# EAGLE design NSL_Tracker-2.0 (EAGLE 5.11)

## Sheet 1 of 6
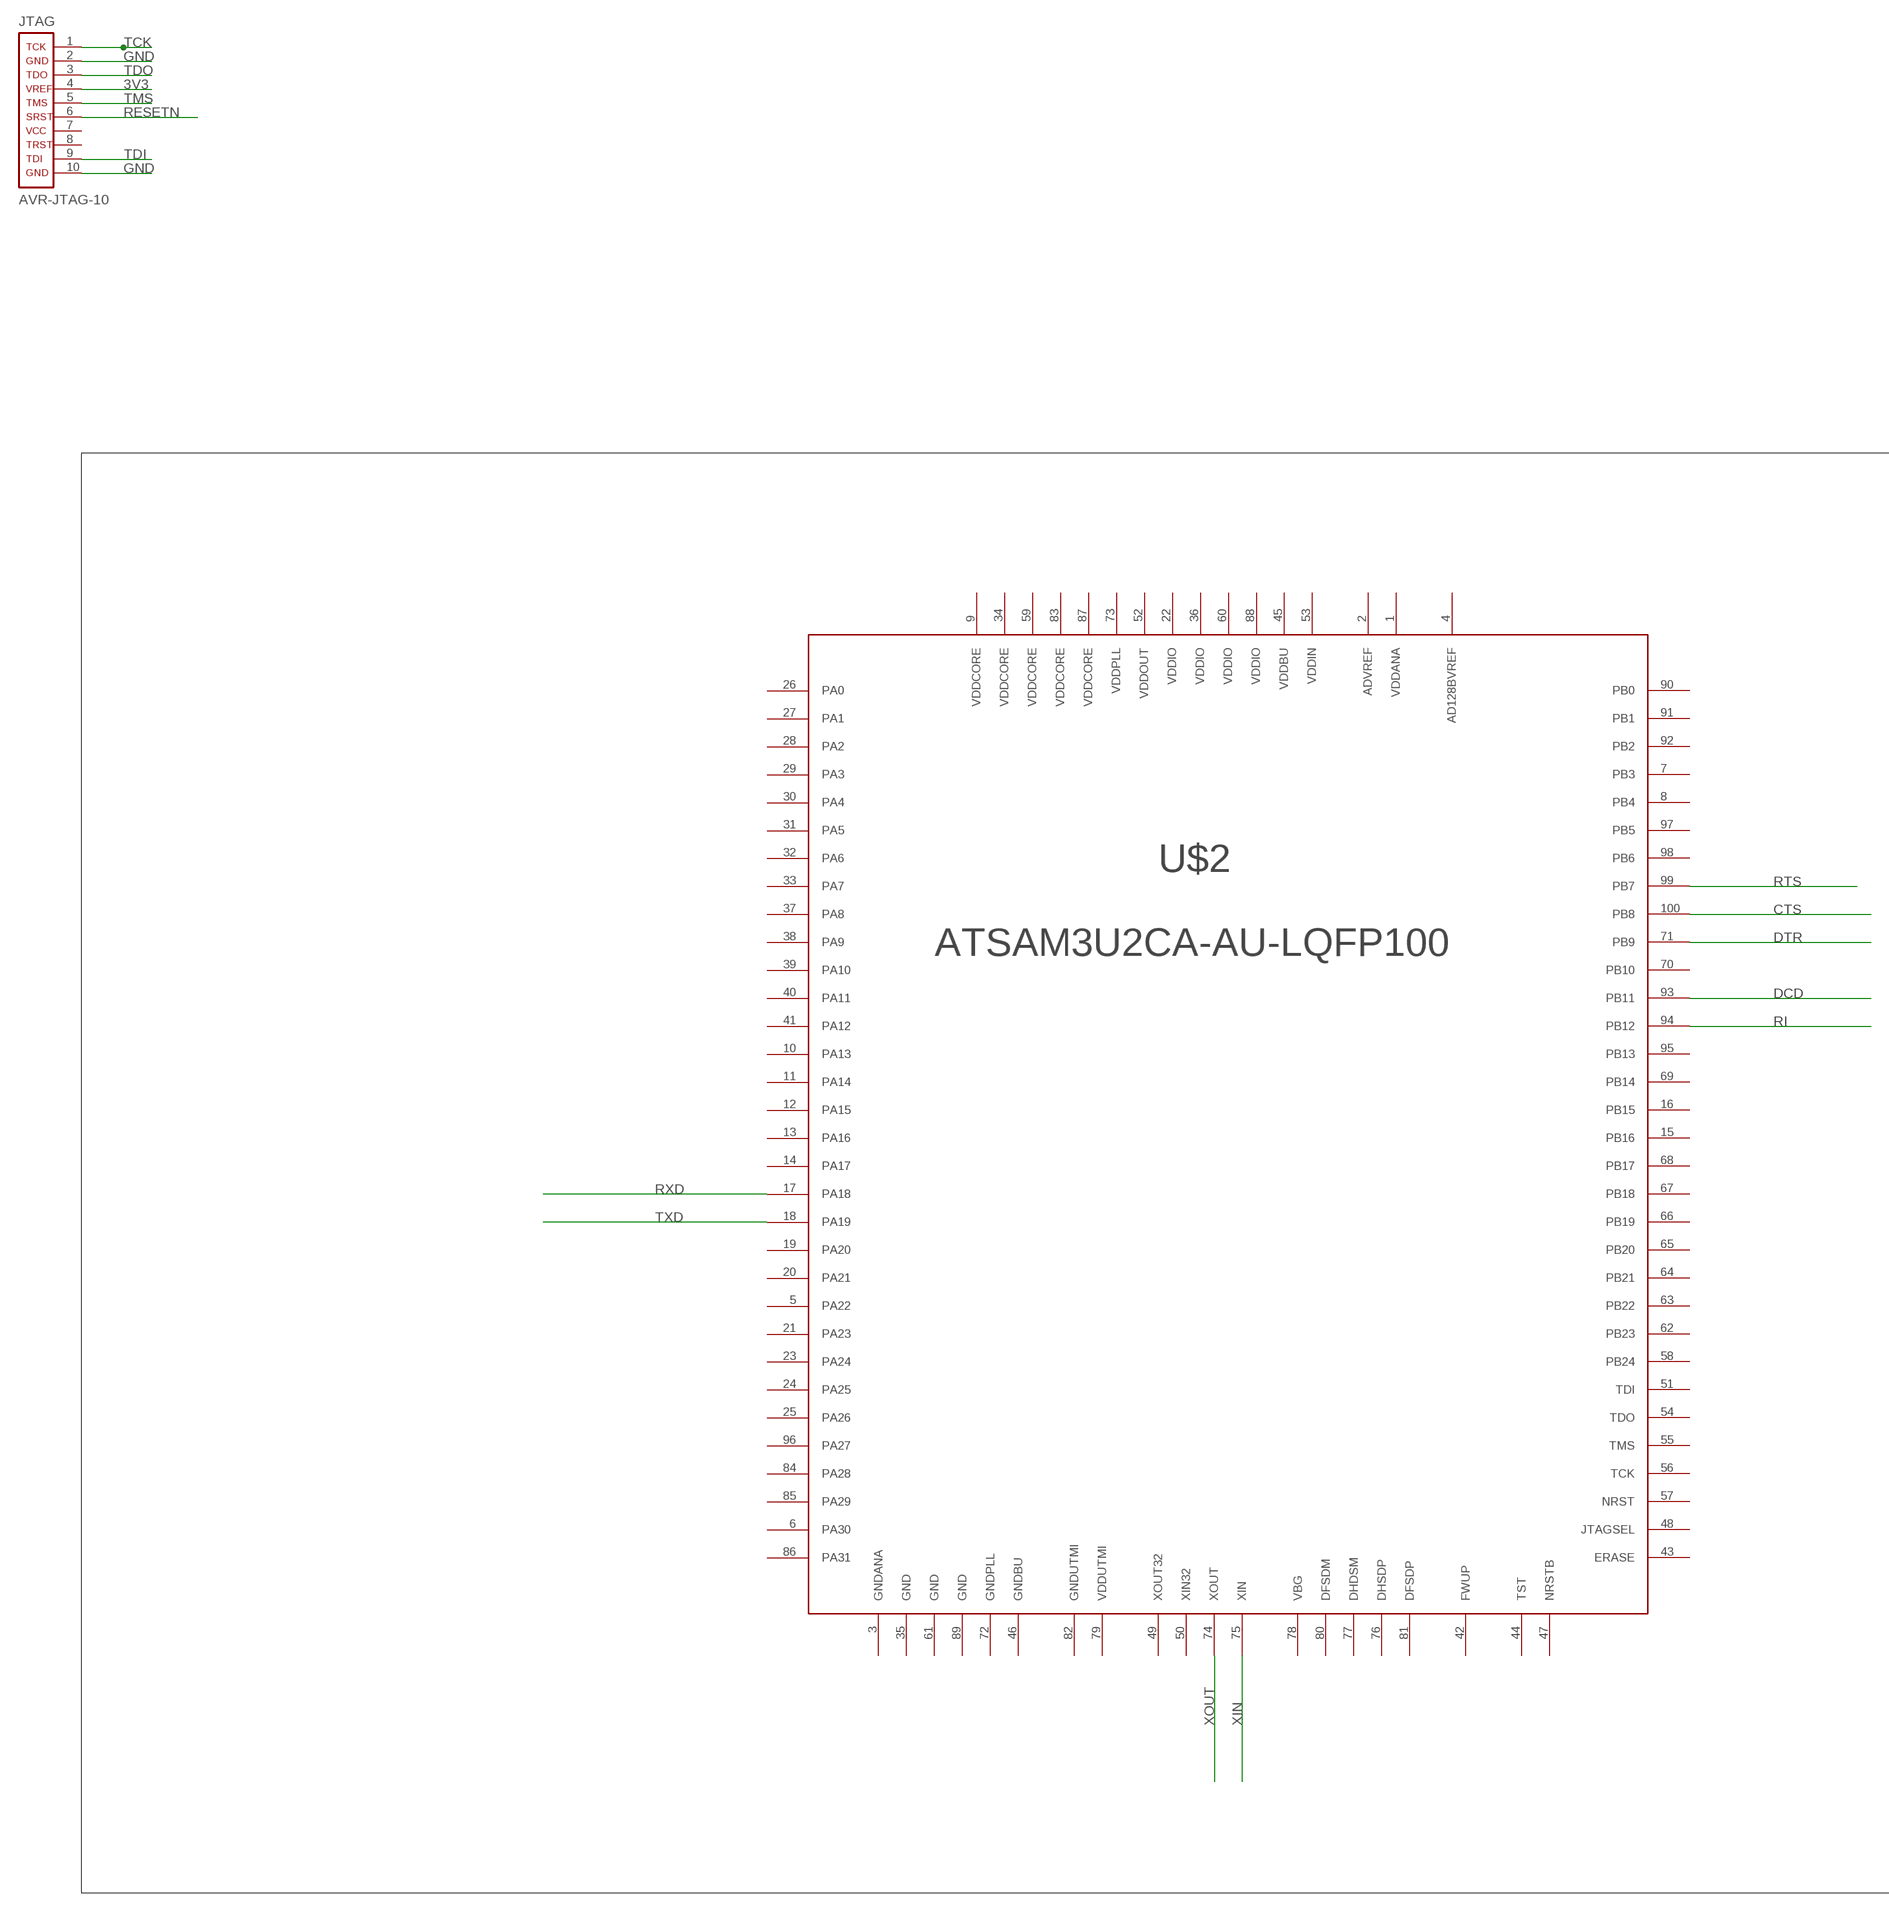
[diagram p0: schematic, sheet 1, part 1 of 2]
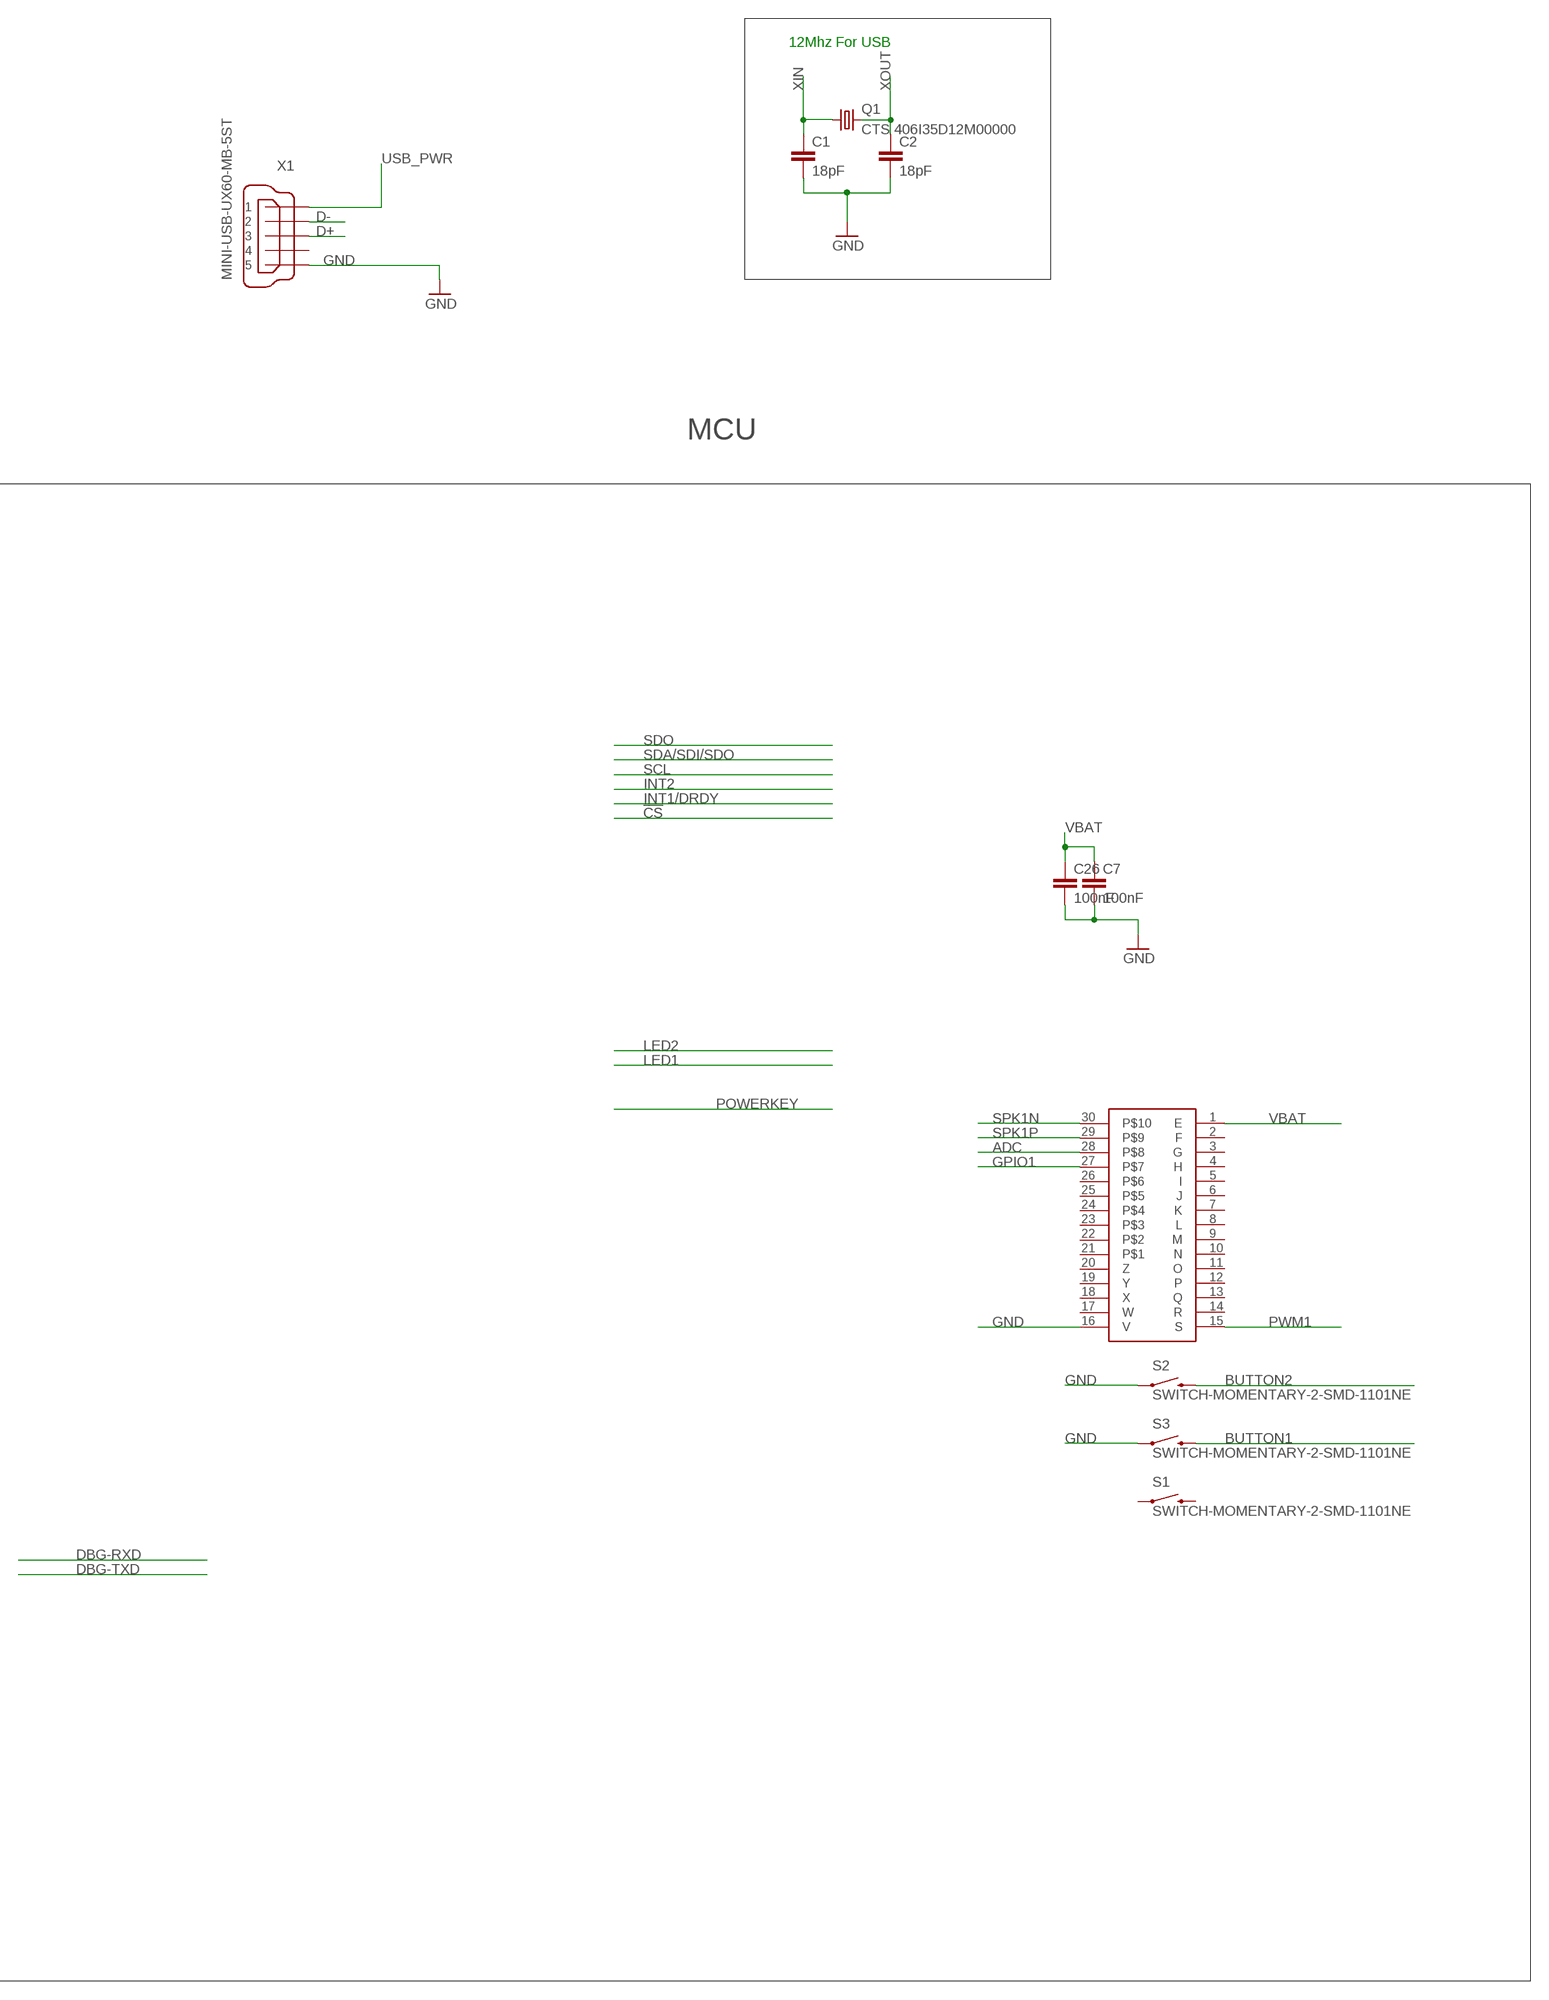
[diagram p1: schematic, sheet 1, part 2 of 2]

### Parts
C1  18pF  CAP0805  [0805]
C2  18pF  CAP0805  [0805]
C7  100nF  CAP0805  [0805]
C26  100nF  CAP0805  [0805]
JTAG  AVR-JTAG-10  [AVR-JTAG-10]
Q1  CTS 406I35D12M00000  CRYSTALCTS406  [CTS406]
S1  SWITCH-MOMENTARY-2-SMD-1101NE  [TACTILE-SWITCH-1101NE]
S2  SWITCH-MOMENTARY-2-SMD-1101NE  [TACTILE-SWITCH-1101NE]
S3  SWITCH-MOMENTARY-2-SMD-1101NE  [TACTILE-SWITCH-1101NE]
U$1  M30  [M50-2X15]
U$2  ATSAM3U2CA-AU-LQFP100  [LQFP100]
X1  MINI-USB-UX60-MB-5ST  [UX60-MB-5ST]

### Nets
3V3: JTAG.4
ADC: U$1.28 ; also sheet 2
BUTTON1: S3.P$2
BUTTON2: S2.P$2
CTS: U$2.100(PB8) ; also sheet 2
D+: X1.3
D-: X1.2
DCD: U$2.93(PB11) ; also sheet 2
DTR: U$2.71(PB9) ; also sheet 2
GND: C1.2 C2.2 C7.2 C26.2 JTAG.2 JTAG.10 S2.P$1 S3.P$1 U$1.16(V) X1.5 ; also sheet 2,3,4,5,6
GPIO1: U$1.27 ; also sheet 2
PWM1: U$1.15(S) ; also sheet 2
RESETN: JTAG.6
RI: U$2.94(PB12) ; also sheet 2
RTS: U$2.99(PB7) ; also sheet 2
RXD: U$2.17(PA18) ; also sheet 2
SPK1N: U$1.30 ; also sheet 2
SPK1P: U$1.29 ; also sheet 2
TCK: JTAG.1
TDI: JTAG.9
TDO: JTAG.3
TMS: JTAG.5
TXD: U$2.18(PA19) ; also sheet 2
USB_PWR: X1.1 ; also sheet 4
VBAT: C7.1 C26.1 U$1.1(E) ; also sheet 2,3,4,6
XIN: C1.1 Q1.1 U$2.75(XIN)
XOUT: C2.1 Q1.3 U$2.74(XOUT)
Unconnected: JTAG.7 JTAG.8 S1.P$1 S1.P$2 U$1.2(F) U$1.3(G) U$1.4(H) U$1.5(I) U$1.6(J) U$1.7(K) U$1.8(L) U$1.9(M) U$1.10(N) U$1.11(O) U$1.12(P) U$1.13(Q) U$1.14(R) U$1.17(W) U$1.18(X) U$1.19(Y) U$1.20(Z) U$1.21 U$1.22 U$1.23 U$1.24 U$1.25 U$1.26 U$2.1(VDDANA) U$2.2(ADVREF) U$2.3(GNDANA) U$2.4(AD128BVREF) U$2.5(PA22) U$2.6(PA30) U$2.7(PB3) U$2.8(PB4) U$2.9(VDDCORE) U$2.10(PA13) U$2.11(PA14) U$2.12(PA15) U$2.13(PA16) U$2.14(PA17) U$2.15(PB16) U$2.16(PB15) U$2.19(PA20) U$2.20(PA21) U$2.21(PA23) U$2.22(VDDIO) U$2.23(PA24) U$2.24(PA25) U$2.25(PA26) U$2.26(PA0) U$2.27(PA1) U$2.28(PA2) U$2.29(PA3) U$2.30(PA4) U$2.31(PA5) U$2.32(PA6) U$2.33(PA7) U$2.34(VDDCORE) U$2.35(GND) U$2.36(VDDIO) U$2.37(PA8) U$2.38(PA9) U$2.39(PA10) U$2.40(PA11) U$2.41(PA12) U$2.42(FWUP) U$2.43(ERASE) U$2.44(TST) U$2.45(VDDBU) U$2.46(GNDBU) U$2.47(NRSTB) U$2.48(JTAGSEL) U$2.49(XOUT32) U$2.50(XIN32) U$2.51(TDI) U$2.52(VDDOUT) U$2.53(VDDIN) U$2.54(TDO) U$2.55(TMS) U$2.56(TCK) U$2.57(NRST) U$2.58(PB24) U$2.59(VDDCORE) U$2.60(VDDIO) U$2.61(GND) U$2.62(PB23) U$2.63(PB22) U$2.64(PB21) U$2.65(PB20) U$2.66(PB19) U$2.67(PB18) U$2.68(PB17) U$2.69(PB14) U$2.70(PB10) U$2.72(GNDPLL) U$2.73(VDDPLL) U$2.76(DHSDP) U$2.77(DHDSM) U$2.78(VBG) U$2.79(VDDUTMI) U$2.80(DFSDM) U$2.81(DFSDP) U$2.82(GNDUTMI) U$2.83(VDDCORE) U$2.84(PA28) U$2.85(PA29) U$2.86(PA31) U$2.87(VDDCORE) U$2.88(VDDIO) U$2.89(GND) U$2.90(PB0) U$2.91(PB1) U$2.92(PB2) U$2.95(PB13) U$2.96(PA27) U$2.97(PB5) U$2.98(PB6) X1.4

### Notes on the sheet
- 12Mhz For USB
- MCU

## Sheet 2 of 6
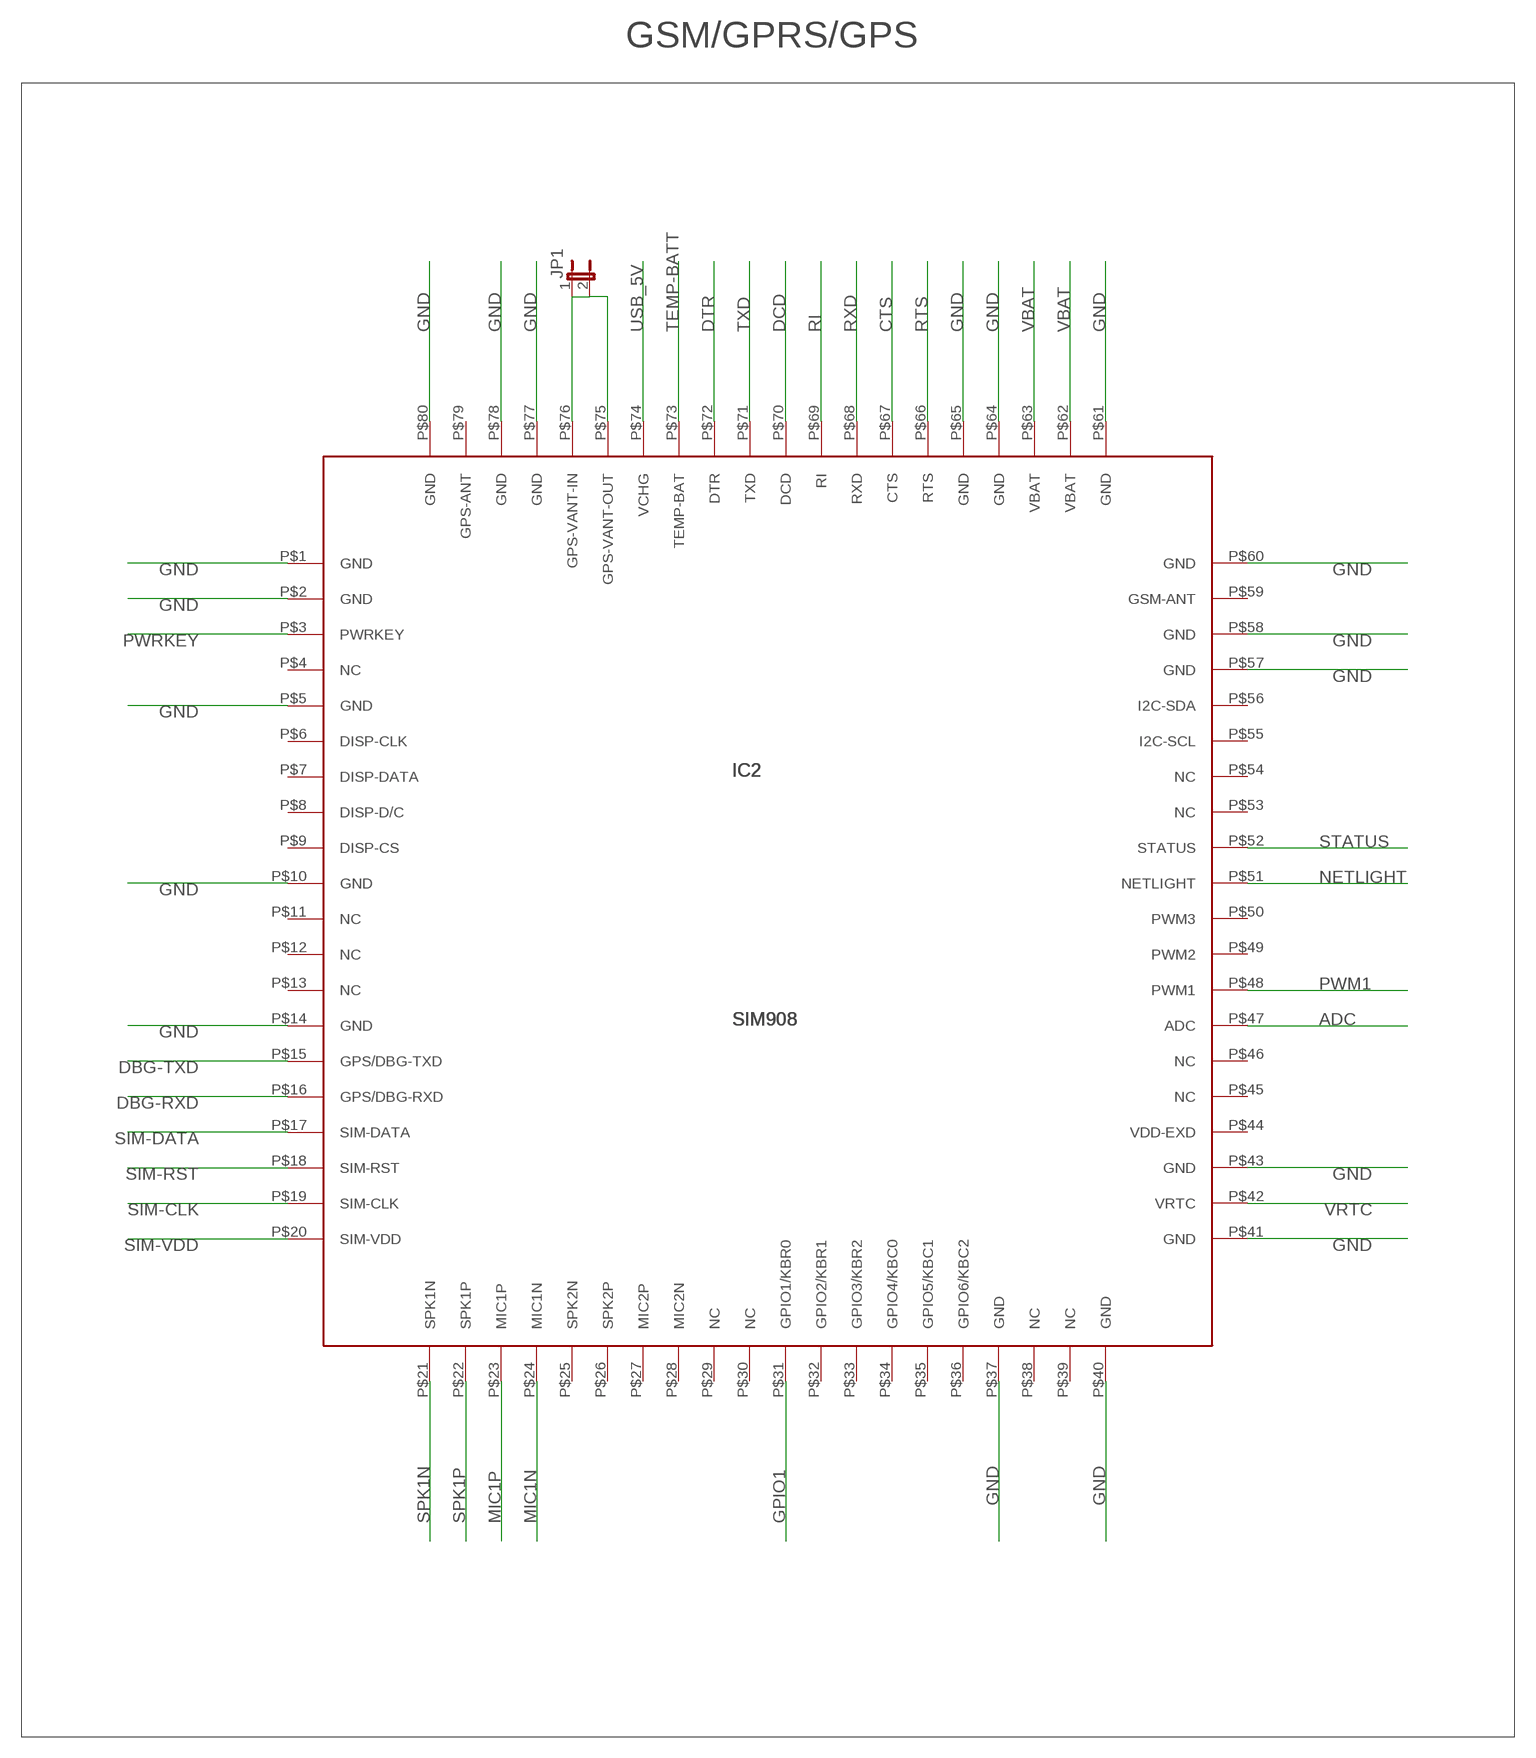
[diagram p2: schematic, sheet 2]

### Parts
IC2  SIM908  [SIM908]
JP1  JUMPER-2SMD-NC  [SJ_2S]

### Nets
ADC: IC2.P$47(ADC) ; also sheet 1
CTS: IC2.P$67(CTS) ; also sheet 1
DBG-RXD: IC2.P$16(GPS/DBG-RXD) ; also sheet 1
DBG-TXD: IC2.P$15(GPS/DBG-TXD) ; also sheet 1
DCD: IC2.P$70(DCD) ; also sheet 1
DTR: IC2.P$72(DTR) ; also sheet 1
GND: IC2.P$1(GND) IC2.P$2(GND) IC2.P$5(GND) IC2.P$10(GND) IC2.P$14(GND) IC2.P$37(GND) IC2.P$40(GND) IC2.P$41(GND) IC2.P$43(GND) IC2.P$57(GND) IC2.P$58(GND) IC2.P$60(GND) IC2.P$61(GND) IC2.P$64(GND) IC2.P$65(GND) IC2.P$77(GND) IC2.P$78(GND) IC2.P$80(GND) ; also sheet 1,3,4,5,6
GPIO1: IC2.P$31(GPIO1/KBR0) ; also sheet 1
MIC1N: IC2.P$24(MIC1N) ; also sheet 5
MIC1P: IC2.P$23(MIC1P) ; also sheet 5
N$4: IC2.P$75(GPS-VANT-OUT) IC2.P$76(GPS-VANT-IN) JP1.1 JP1.2
NETLIGHT: IC2.P$51(NETLIGHT) ; also sheet 3
PWM1: IC2.P$48(PWM1) ; also sheet 1
PWRKEY: IC2.P$3(PWRKEY) ; also sheet 3
RI: IC2.P$69(RI) ; also sheet 1
RTS: IC2.P$66(RTS) ; also sheet 1
RXD: IC2.P$68(RXD) ; also sheet 1
SIM-CLK: IC2.P$19(SIM-CLK) ; also sheet 3
SIM-DATA: IC2.P$17(SIM-DATA) ; also sheet 3
SIM-RST: IC2.P$18(SIM-RST) ; also sheet 3
SIM-VDD: IC2.P$20(SIM-VDD) ; also sheet 3
SPK1N: IC2.P$21(SPK1N) ; also sheet 1
SPK1P: IC2.P$22(SPK1P) ; also sheet 1
STATUS: IC2.P$52(STATUS) ; also sheet 3
TEMP-BATT: IC2.P$73(TEMP-BAT) ; also sheet 4
TXD: IC2.P$71(TXD) ; also sheet 1
USB_5V: IC2.P$74(VCHG) ; also sheet 4
VBAT: IC2.P$62(VBAT) IC2.P$63(VBAT) ; also sheet 1,3,4,6
VRTC: IC2.P$42(VRTC) ; also sheet 4
Unconnected: IC2.P$4(NC) IC2.P$6(DISP-CLK) IC2.P$7(DISP-DATA) IC2.P$8(DISP-D/C) IC2.P$9(DISP-CS) IC2.P$11(NC) IC2.P$12(NC) IC2.P$13(NC) IC2.P$25(SPK2N) IC2.P$26(SPK2P) IC2.P$27(MIC2P) IC2.P$28(MIC2N) IC2.P$29(NC) IC2.P$30(NC) IC2.P$32(GPIO2/KBR1) IC2.P$33(GPIO3/KBR2) IC2.P$34(GPIO4/KBC0) IC2.P$35(GPIO5/KBC1) IC2.P$36(GPIO6/KBC2) IC2.P$38(NC) IC2.P$39(NC) IC2.P$44(VDD-EXD) IC2.P$45(NC) IC2.P$46(NC) IC2.P$49(PWM2) IC2.P$50(PWM3) IC2.P$53(NC) IC2.P$54(NC) IC2.P$55(I2C-SCL) IC2.P$56(I2C-SDA) IC2.P$59(GSM-ANT) IC2.P$79(GPS-ANT)

### Notes on the sheet
- GSM/GPRS/GPS

## Sheet 3 of 6
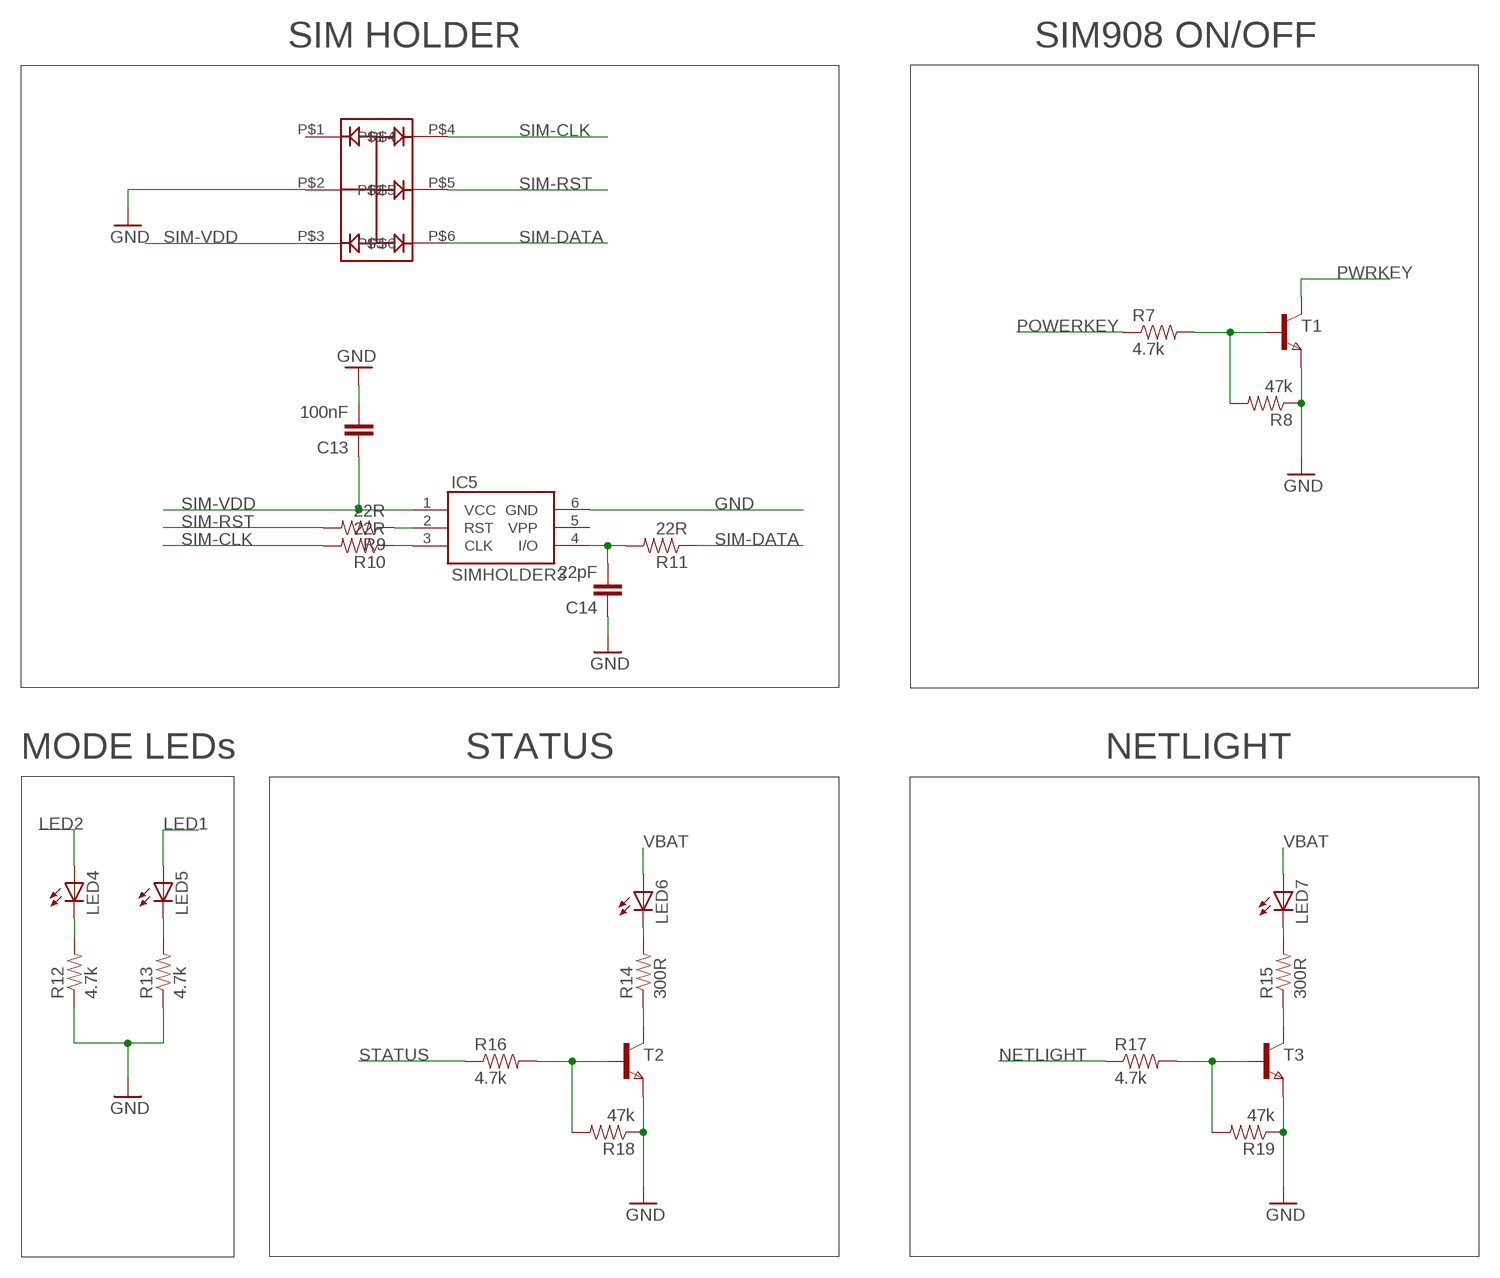
[diagram p3: schematic, sheet 3]

### Parts
C13  100nF  CAP0805  [0805]
C14  22pF  CAP0805  [0805]
IC4  SMF05C  [SC-88]
IC5  SIMHOLDER3  [SIMHOLDER3]
LED4  LEDCHIP-LED0603  [CHIP-LED0603]
LED5  LEDCHIP-LED0603  [CHIP-LED0603]
LED6  LEDCHIP-LED0603  [CHIP-LED0603]
LED7  LEDCHIP-LED0603  [CHIP-LED0603]
R7  4.7k  RESISTOR0805-RES  [0805]
R8  47k  RESISTOR0805-RES  [0805]
R9  22R  RESISTOR0805-RES  [0805]
R10  22R  RESISTOR0805-RES  [0805]
R11  22R  RESISTOR0805-RES  [0805]
R12  4.7k  RESISTOR0805-RES  [0805]
R13  4.7k  RESISTOR0805-RES  [0805]
R14  300R  RESISTOR0805-RES  [0805]
R15  300R  RESISTOR0805-RES  [0805]
R16  4.7k  RESISTOR0805-RES  [0805]
R17  4.7k  RESISTOR0805-RES  [0805]
R18  47k  RESISTOR0805-RES  [0805]
R19  47k  RESISTOR0805-RES  [0805]
T1  NPNSOT23  [SOT-23]
T2  NPNSOT23  [SOT-23]
T3  NPNSOT23  [SOT-23]

### Nets
GND: C13.2 C14.1 IC4.P$2 IC5.6(GND) R8.1 R12.1 R13.1 R18.1 R19.1 T1.2(E) T2.2(E) T3.2(E) ; also sheet 1,2,4,5,6
LED1: LED5.A ; also sheet 1
LED2: LED4.A ; also sheet 1
N$6: R17.2 R19.2 T3.3(B)
N$7: R7.2 R8.2 T1.3(B)
N$8: IC5.2(RST) R9.1
N$9: IC5.3(CLK) R10.1
N$10: C14.2 IC5.4(I/O) R11.2
N$11: LED7.C R15.2
N$12: R15.1 T3.1(C)
N$13: R16.2 R18.2 T2.3(B)
N$14: LED6.C R14.2
N$15: R14.1 T2.1(C)
N$20: LED5.C R13.2
N$21: LED4.C R12.2
NETLIGHT: R17.1 ; also sheet 2
POWERKEY: R7.1 ; also sheet 1
PWRKEY: T1.1(C) ; also sheet 2
SIM-CLK: IC4.P$4 R10.2 ; also sheet 2
SIM-DATA: IC4.P$6 R11.1 ; also sheet 2
SIM-RST: IC4.P$5 R9.2 ; also sheet 2
SIM-VDD: C13.1 IC4.P$3 IC5.1(VCC) ; also sheet 2
STATUS: R16.1 ; also sheet 2
VBAT: LED6.A LED7.A ; also sheet 1,2,4,6
Unconnected: IC4.P$1 IC5.5(VPP)

### Notes on the sheet
- SIM HOLDER | SIM908 ON/OFF
- MODE LEDs | STATUS | NETLIGHT

## Sheet 4 of 6
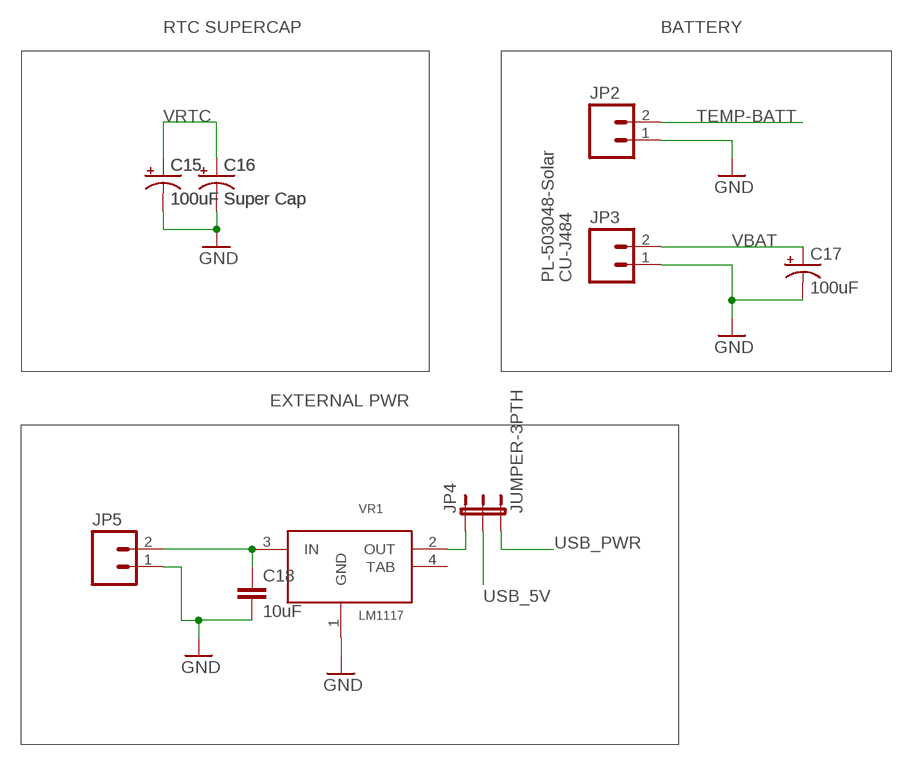
[diagram p4: schematic, sheet 4]

### Parts
C15  100uF  CAP_POL7343  [EIA7343]
C16  Super Cap  CAP_POL322510  [322510_SUPERCAP]
C17  100uF  CAP_POL7343  [EIA7343]
C18  10uF  CAP0805  [0805]
JP2  M02PTH  [1X02]
JP3  M02POLAR  [MOLEX-1X2]
JP4  JUMPER-3PTH  [1X03]
JP5  M02POLAR  [MOLEX-1X2]
VR1  LM1117  [SOT-223]

### Nets
GND: C15.C(-) C16.2(-) C17.C(-) C18.2 JP2.1 JP3.1 JP5.1 VR1.1(GND) ; also sheet 1,2,3,5,6
N$16: C18.1 JP5.2 VR1.3(IN)
N$17: JP4.1 VR1.2(OUT)
TEMP-BATT: JP2.2 ; also sheet 2
USB_5V: JP4.2 ; also sheet 2
USB_PWR: JP4.3 ; also sheet 1
VBAT: C17.A(+) JP3.2 ; also sheet 1,2,3,6
VRTC: C15.A(+) C16.1(+) ; also sheet 2
Unconnected: VR1.4(TAB)

### Notes on the sheet
- RTC SUPERCAP | BATTERY
- PL-503048-Solar | CU-J484
- EXTERNAL PWR

## Sheet 5 of 6
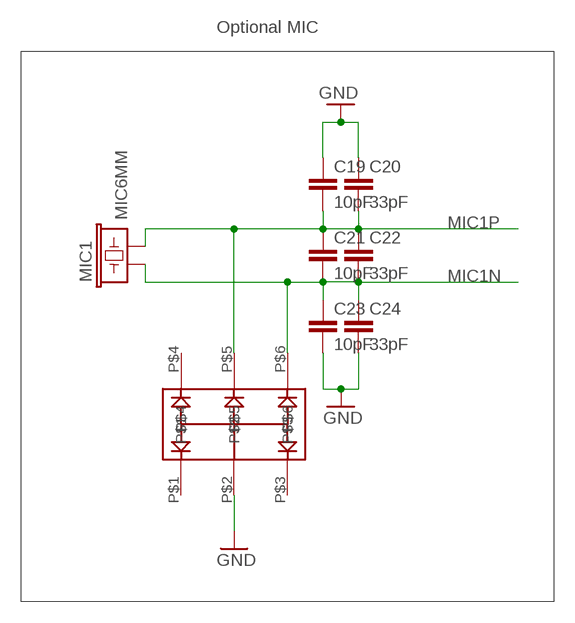
[diagram p5: schematic, sheet 5]

### Parts
C19  10pF  CAP0805  [0805]
C20  33pF  CAP0805  [0805]
C21  10pF  CAP0805  [0805]
C22  33pF  CAP0805  [0805]
C23  10pF  CAP0805  [0805]
C24  33pF  CAP0805  [0805]
IC6  SMF05C  [SC-88]
MIC1  MIC6MM  [MIC-6MM]

### Nets
GND: C19.1 C20.1 C23.2 C24.2 IC6.P$2 ; also sheet 1,2,3,4,6
MIC1N: C21.2 C22.2 C23.1 C24.1 IC6.P$6 MIC1.1 ; also sheet 2
MIC1P: C19.2 C20.2 C21.1 C22.1 IC6.P$5 MIC1.2 ; also sheet 2
Unconnected: IC6.P$1 IC6.P$3 IC6.P$4

### Notes on the sheet
- Optional MIC

## Sheet 6 of 6
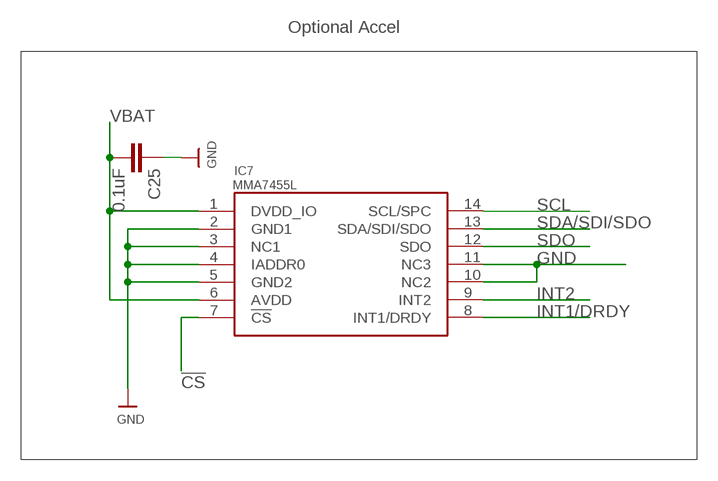
[diagram p6: schematic, sheet 6]

### Parts
C25  0.1uF  CAP0805  [0805]
IC7  MMA7455L  [LGA-14]

### Nets
!CS: IC7.7(!CS) ; also sheet 1
GND: C25.1 IC7.2(GND1) IC7.3(NC1) IC7.4(IADDR0) IC7.5(GND2) IC7.10(NC2) IC7.11(NC3) ; also sheet 1,2,3,4,5
INT1/DRDY: IC7.8(INT1/DRDY) ; also sheet 1
INT2: IC7.9(INT2) ; also sheet 1
SCL: IC7.14(SCL/SPC) ; also sheet 1
SDA/SDI/SDO: IC7.13(SDA/SDI/SDO) ; also sheet 1
SDO: IC7.12(SDO) ; also sheet 1
VBAT: C25.2 IC7.1(DVDD_IO) IC7.6(AVDD) ; also sheet 1,2,3,4

### Notes on the sheet
- Optional Accel

## Library data of the parts
C1 C2 C7 C13 C14 C18-C26 = SparkFun:CAP: Capacitor Standard 0603 ceramic capacitor, and 0.1" leaded capacitor.
C15 C16 = NSL_Tracker:CAP_POL: Capacitor Polarized These are standard SMD and PTH capacitors. Normally 10uF, 47uF, and 100uF in electrolytic and tantalum varieties. Always verify the external diameter of the through hole cap, it varies with capacity, voltage, and manufacturer. The EIA devices should be standard.
C17 = SparkFun:CAP_POL: Capacitor Polarized These are standard SMD and PTH capacitors. Normally 10uF, 47uF, and 100uF in electrolytic and tantalum varieties. Always verify the external diameter of the through hole cap, it varies with capacity, voltage, and manufacturer. The EIA devices should be standard.
IC2 = NSL_Tracker:SIM908
IC4 IC6 = NSL_Tracker:SMF05C
IC5 = SparkFun:SIMHOLDER3
IC7 = MMA7455Lbreakoutboard-v1a:MMA7455L
JP1 = SparkFun:JUMPER-2: Jumper Basic 0.1" spaced jumper. Use with breakaway headers.
JP2 = SparkFun:M02: Header 2 Standard 2-pin 0.1" header. Use with straight break away headers (SKU : PRT-00116), right angle break away headers (PRT-00553), swiss pins (PRT-00743), machine pins (PRT-00117), and female headers (PRT-00115). Molex polarized connector foot print use with SKU : PRT-08233 with associated crimp pins and housings.
JP3 JP5 = PWM_ATUC64L4U:M02: Header 2 Standard 2-pin 0.1" header. Use with straight break away headers (SKU : PRT-00116), right angle break away headers (PRT-00553), swiss pins (PRT-00743), machine pins (PRT-00117), and female headers (PRT-00115). Molex polarized connector foot print use with SKU : PRT-08233 with associated crimp pins and housings.
JP4 = SparkFun:JUMPER-3
JTAG = atmel-avr32-michel:AVR-JTAG-10: AVR JTAG Debug/Programming Header
LED4-LED7 = led:LED: LED OSRAM: - CHIPLED LG R971, LG N971, LY N971, LG Q971, LY Q971, LO R971, LY R971 LH N974, LH R974 LS Q976, LO Q976, LY Q976 LO Q996 - Hyper CHIPLED LW Q18S LB Q993, LB Q99A, LB R99A - SideLED LS A670, LO A670, LY A670, LG A670, LP A670 LB A673, LV A673, LT A673, LW A673 LH A674 LY A675 LS A676, LA A676, LO A676, LY A676, LW A676 LS A679, LY A679, LG A679 - Hyper Micro SIDELED® LS Y876, LA Y876, LO Y876, LY Y876 LT Y87S - SmartLED LW L88C, LW L88S LB L89C, LB L89S, LG L890 LS L89K, LO L89K, LY L89K LS L896, LA L896, LO L896, LY L896 - TOPLED LS T670, LO T670, LY T670, LG T670, LP T670 LSG T670, LSP T670, LSY T670, LOP T670, LYG T670 LG T671, LOG T671, LSG T671 LB T673, LV T673, LT T673, LW T673 LH T674 LS T676, LA T676, LO T676, LY T676, LB T676, LH T676, LSB T676, LW T676 LB T67C, LV T67C, LT T67C, LS T67K, LO T67K, LY T67K, LW E67C LS E67B, LA E67B, LO E67B, LY E67B, LB E67C, LV E67C, LT E67C LW T67C LS T679, LY T679, LG T679 LS T770, LO T770, LY T770, LG T770, LP T770 LB T773, LV T773, LT T773, LW T773 LH T774 LS E675, LA E675, LY E675, LS T675 LS T776, LA T776, LO T776, LY T776, LB T776 LHGB T686 LT T68C, LB T68C - Hyper Mini TOPLED® LB M676 - Mini TOPLED Santana® LG M470 LS M47K, LO M47K, LY M47K Source: http://www.osram.convergy.de LUXEON: - LUMILED® LXK2-PW12-R00, LXK2-PW12-S00, LXK2-PW14-U00, LXK2-PW14-V00 LXK2-PM12-R00, LXK2-PM12-S00, LXK2-PM14-U00 LXK2-PE12-Q00, LXK2-PE12-R00, LXK2-PE12-S00, LXK2-PE14-T00, LXK2-PE14-U00 LXK2-PB12-K00, LXK2-PB12-L00, LXK2-PB12-M00, LXK2-PB14-N00, LXK2-PB14-P00, LXK2-PB14-Q00 LXK2-PR12-L00, LXK2-PR12-M00, LXK2-PR14-Q00, LXK2-PR14-R00 LXK2-PD12-Q00, LXK2-PD12-R00, LXK2-PD12-S00 LXK2-PH12-R00, LXK2-PH12-S00 LXK2-PL12-P00, LXK2-PL12-Q00, LXK2-PL12-R00 Source: www.luxeon.com KINGBRIGHT: KA-3528ASYC Source: www.kingbright.com
MIC1 = slice_noshift:MIC: Microphone Omni-directional electret microphone. 9.7mm standard diameter.
Q1 = crystal:CRYSTAL: CRYSTAL; OC_FARNELL: unknown; OC_NEWARK: unknown
R7-R19 = SparkFun:RESISTOR: Resistor Basic schematic elements and footprints for 0603, 1206, and PTH resistors.
S1-S3 = NSL_Tracker:SWITCH-MOMENTARY-2
T1-T3 = zetex:NPNSOT23: NPN TRANSISTOR; MPN: DSS20201L-7; OC_FARNELL: 1710688; OC_NEWARK: 25R4555
U$1 = NSL_Tracker:M30
U$2 = NSL_Tracker-2.0:ATSAM3U2CA-AU
VR1 = pcbqr_v4:LM1117
X1 = ATCUxxxl3U_Synth_4layer:MINI-USB-: MINI USB Connector Source: http://www.hirose.co.jp/cataloge_hp/e24000019.pdf; OC_FARNELL: unknown; OC_NEWARK: unknown

## Board
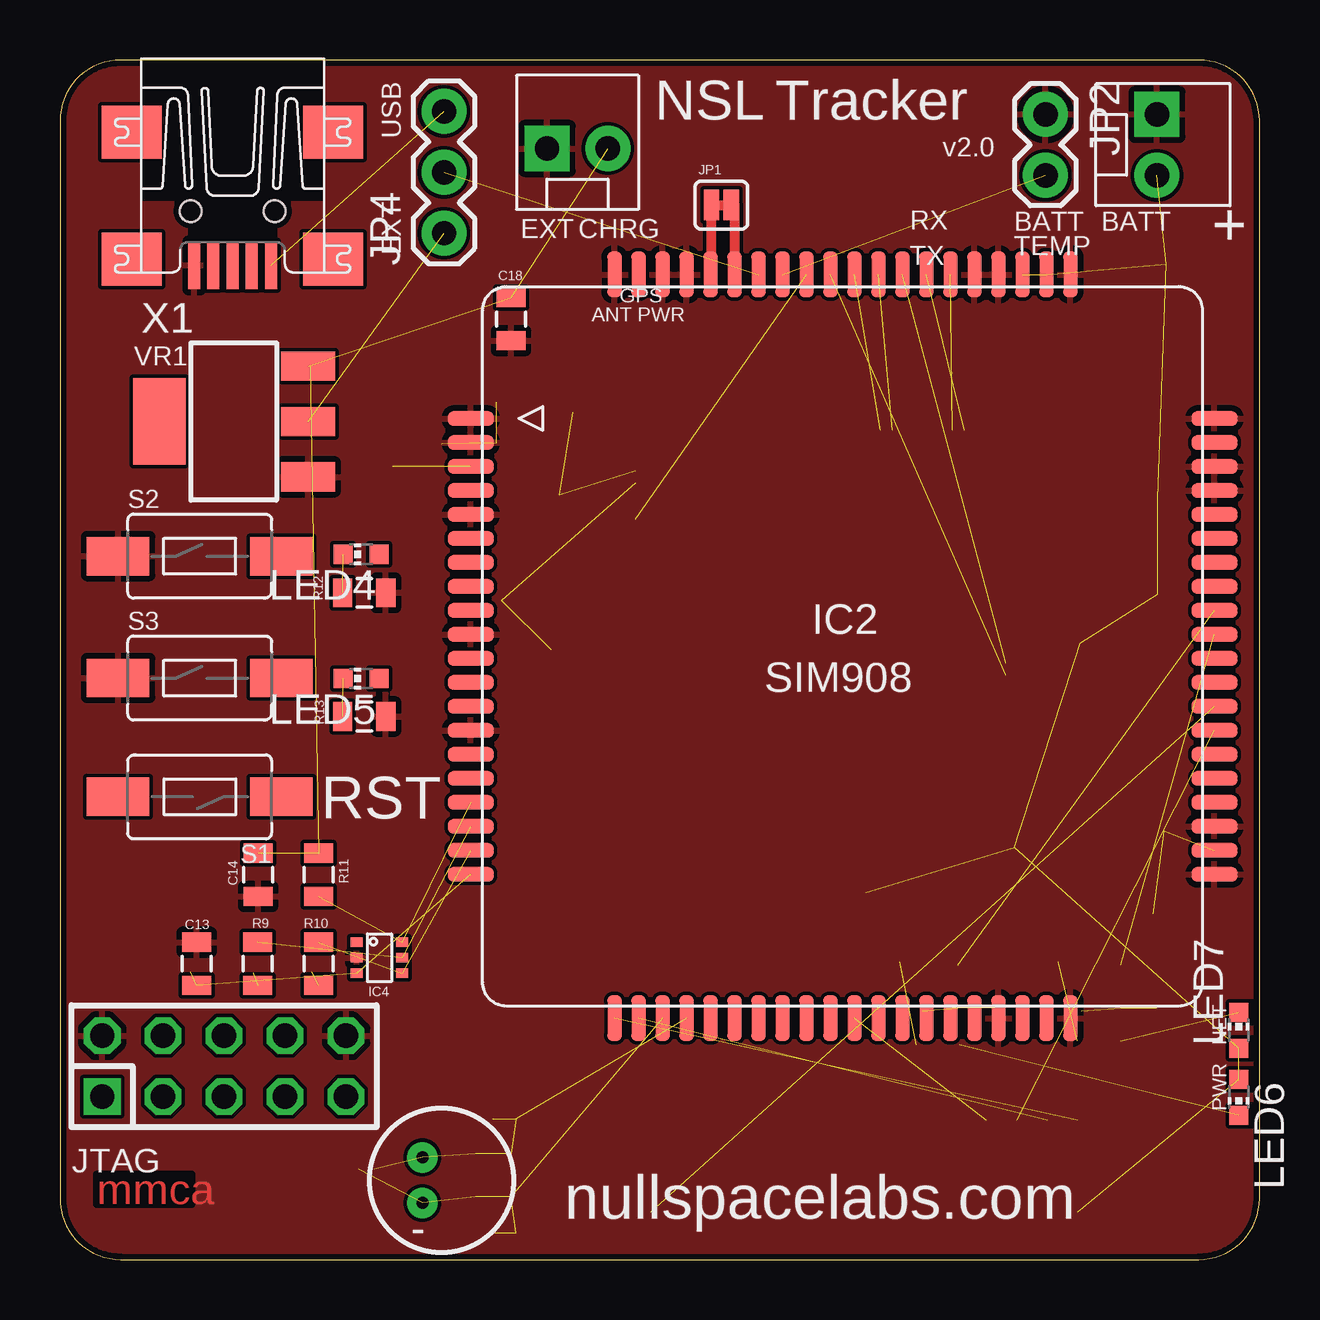
[diagram p7: board, top side]
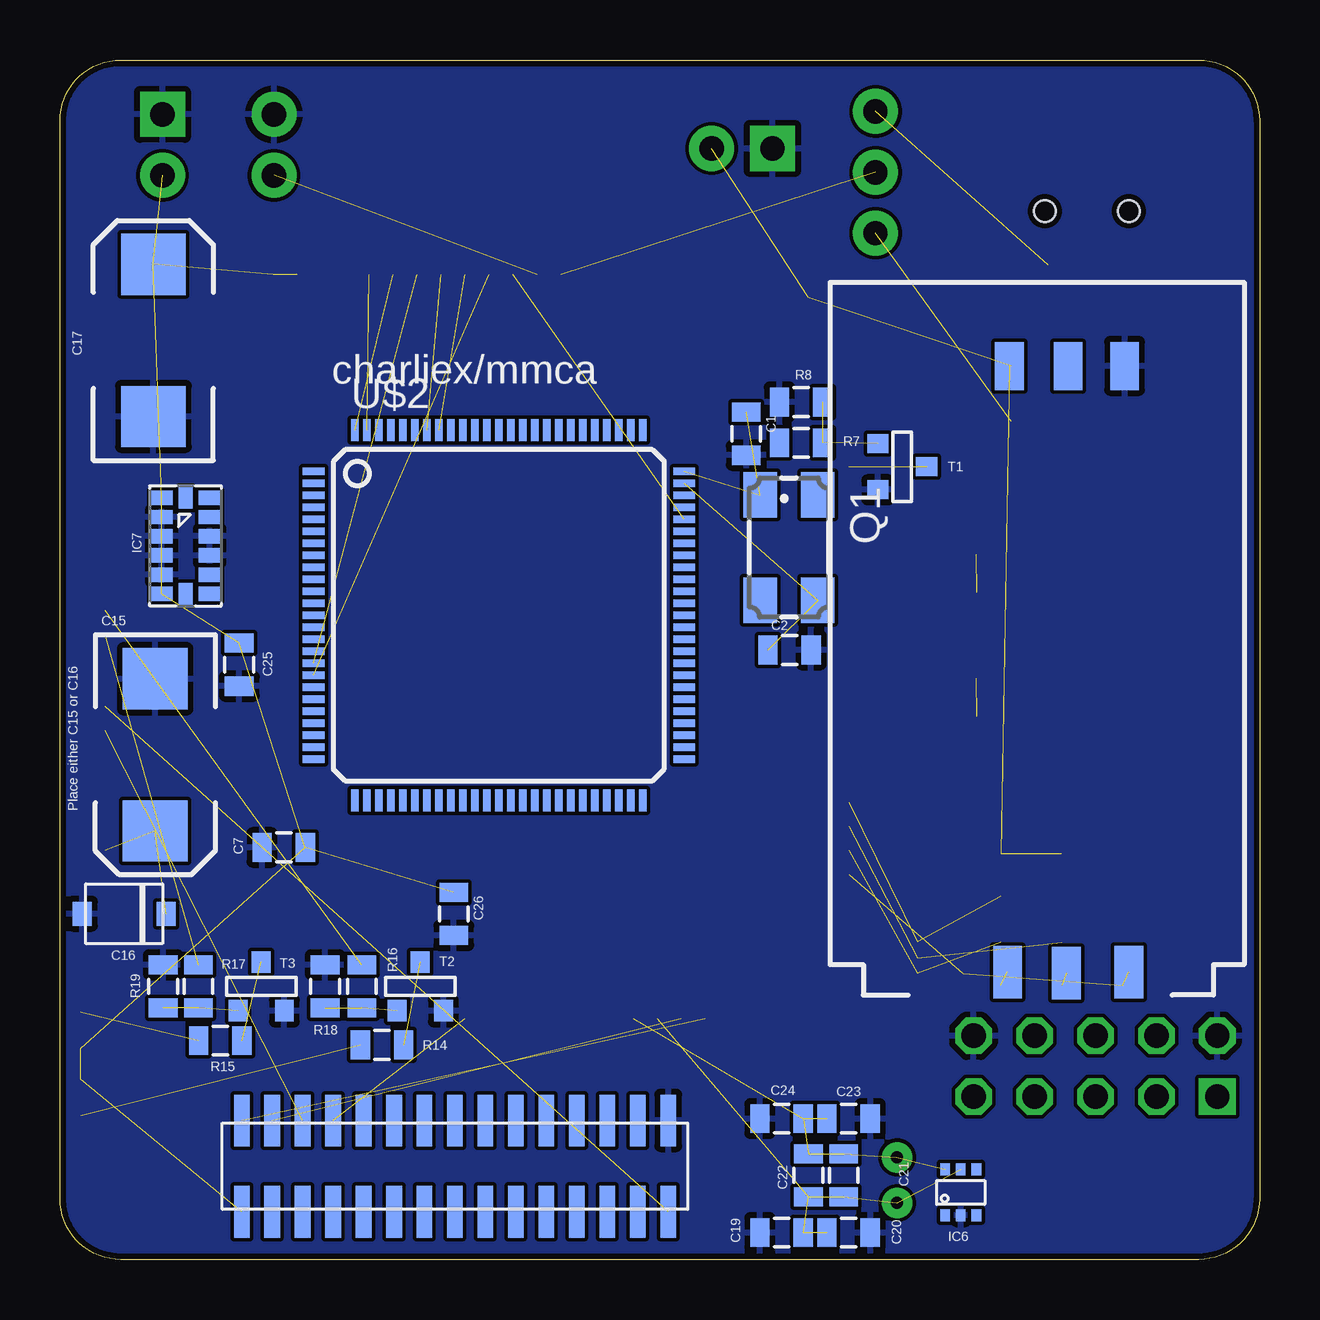
[diagram p8: board, bottom side, seen from below]

Size 50 x 50 mm. Coordinates in mm from the lower left corner, seen from the top.
Outline: 47.46,0 arc90 50,2.54 50,47.46 arc90 47.46,50 2.54,50 arc90 0,47.46 0,2.54 arc90 2.54,0 47.46,0
Copper layers (1*16): Top 0.035mm / dielectric 1.5mm / Bottom 0.035mm
Design rules "ITead_rule *": minimum track width 6mil, minimum drill 12mil, track to track 6mil, track to pad 6mil, pad to pad 6mil, via to via 6mil, smd to smd 0mil, copper to edge 10mil, drill to drill 10mil, minimum pad ring 10mil, minimum via ring 6mil, stop-mask expansion 2mil, vias tented up to drill 19mil, thermal gap 10mil

### Footprints (pad centres in the part's own frame; a part is rotated, then mirrored left to right if it is on the bottom)
0805 = smd 0.8 x 1.2: 1 -0.9,0; 2 0.9,0
EIA7343 = smd 2.55 x 2.7: A 3.17,0; C -3.17,0
322510_SUPERCAP = smd 0.8 x 1: 1 -1.75,0; 2 1.75,0
SIM908 = smd 1.9 x 0.6: P$1 -15.5,9.5; P$2 -15.5,8.5; P$3 -15.5,7.5; P$4 -15.5,6.5; P$5 -15.5,5.5; P$6 -15.5,4.5; P$7 -15.5,3.5; P$8 -15.5,2.5; P$9 -15.5,1.5; P$10 -15.5,0.5; P$11 -15.5,-0.5; P$12 -15.5,-1.5; P$13 -15.5,-2.5; P$14 -15.5,-3.5; P$15 -15.5,-4.5; P$16 -15.5,-5.5; P$17 -15.5,-6.5; P$18 -15.5,-7.5; P$19 -15.5,-8.5; P$20 -15.5,-9.5; P$41 15.5,-9.5; P$42 15.5,-8.5; P$43 15.5,-7.5; P$44 15.5,-6.5; P$45 15.5,-5.5; P$46 15.5,-4.5; P$47 15.5,-3.5; P$48 15.5,-2.5; P$49 15.5,-1.5; P$50 15.5,-0.5; P$51 15.5,0.5; P$52 15.5,1.5; P$53 15.5,2.5; P$54 15.5,3.5; P$55 15.5,4.5; P$56 15.5,5.5; P$57 15.5,6.5; P$58 15.5,7.5; P$59 15.5,8.5; P$60 15.5,9.5 | smd 0.6 x 1.9: P$21 -9.5,-15.5; P$22 -8.5,-15.5; P$23 -7.5,-15.5; P$24 -6.5,-15.5; P$25 -5.5,-15.5; P$26 -4.5,-15.5; P$27 -3.5,-15.5; P$28 -2.5,-15.5; P$29 -1.5,-15.5; P$30 -0.5,-15.5; P$31 0.5,-15.5; P$32 1.5,-15.5; P$33 2.5,-15.5; P$34 3.5,-15.5; P$35 4.5,-15.5; P$36 5.5,-15.5; P$37 6.5,-15.5; P$38 7.5,-15.5; P$39 8.5,-15.5; P$40 9.5,-15.5; P$61 9.5,15.5; P$62 8.5,15.5; P$63 7.5,15.5; P$64 6.5,15.5; P$65 5.5,15.5; P$66 4.5,15.5; P$67 3.5,15.5; P$68 2.5,15.5; P$69 1.5,15.5; P$70 0.5,15.5; P$71 -0.5,15.5; P$72 -1.5,15.5; P$73 -2.5,15.5; P$74 -3.5,15.5; P$75 -4.5,15.5; P$76 -5.5,15.5; P$77 -6.5,15.5; P$78 -7.5,15.5; P$79 -8.5,15.5; P$80 -9.5,15.5
SC-88 = smd 0.4 x 0.5: P$1 -0.65,-0.95; P$2 0,-0.95; P$3 0.65,-0.95; P$4 0.65,0.95; P$5 0,0.95; P$6 -0.65,0.95
SIMHOLDER3 = smd 2.2 x 1.2: 1 0.95,4.81; 2 0.91,7.41; 3 0.95,9.86 | smd 2 x 1.2: 4 26.2,9.78; 5 26.22,7.34; 6 26.22,4.98
LGA-14 = smd 0.6 x 0.9: 1 -2,-1; 2 -1.2,-1; 3 -0.4,-1; 4 0.4,-1; 5 1.2,-1; 6 2,-1; 8 2,1; 9 1.2,1; 10 0.4,1; 11 -0.4,1; 12 -1.2,1; 13 -2,1 | smd 0.9 x 0.6: 7 2,0; 14 -2,0
SJ_2S = smd 0.635 x 1.27: 1 -0.412,0; 2 0.412,0
1X02 = drill 1.016 pad 1.88 round: 1 0,0; 2 2.54,0
MOLEX-1X2 = drill 1.016 pad 1.88 square: 1 0,0 | drill 1.016 pad 1.88 round: 2 2.54,0
1X03 = drill 1.016 pad 1.88 round: 1 0,0; 2 2.54,0; 3 5.08,0
AVR-JTAG-10 = drill 1.016 square: 1 -5.08,-1.27 | drill 1.016 octagon: 2 -5.08,1.27; 3 -2.54,-1.27; 4 -2.54,1.27; 5 0,-1.27; 6 0,1.27; 7 2.54,-1.27; 8 2.54,1.27; 9 5.08,-1.27; 10 5.08,1.27
CHIP-LED0603 = smd 0.8 x 0.8: A 0,-0.75; C 0,0.75
MIC-6MM = drill 0.5 pad 1.27 round: 1 -0.8,0.95; 2 -0.8,-0.95
CTS406 = smd 1.9 x 1.4: 1 -2.2,-1.2; 2 2.2,-1.2; 3 2.2,1.2; 4 -2.2,1.2
TACTILE-SWITCH-1101NE = smd 2.6 x 1.6: P$1 -3.4,0; P$2 3.4,0
SOT-23 = smd 0.787 x 0.889: 1 0.025,-1.016; 2 -0.94,1.016; 3 0.991,1.016
M50-2X15 = smd 0.65 x 2.15: 1 -8.89,-1.905; 2 -7.62,-1.905; 3 -6.35,-1.905; 4 -5.08,-1.905; 5 -3.81,-1.905; 6 -2.54,-1.905; 7 -1.27,-1.905; 8 0,-1.905; 9 1.27,-1.905; 10 2.54,-1.905; 11 3.81,-1.905; 12 5.08,-1.905; 13 6.35,-1.905; 14 7.62,-1.905; 15 8.89,-1.905; 16 8.89,1.905; 17 7.62,1.905; 18 6.35,1.905; 19 5.08,1.905; 20 3.81,1.905; 21 2.54,1.905; 22 1.27,1.905; 23 0,1.905; 24 -1.27,1.905; 25 -2.54,1.905; 26 -3.81,1.905; 27 -5.08,1.905; 28 -6.35,1.905; 29 -7.62,1.905; 30 -8.89,1.905
LQFP100 = smd 0.9 x 0.3: 1 -7.72,6; 2 -7.72,5.5; 3 -7.72,5; 4 -7.72,4.5; 5 -7.72,4; 6 -7.72,3.5; 7 -7.72,3; 8 -7.72,2.5; 9 -7.72,2; 10 -7.72,1.5; 11 -7.72,1; 12 -7.72,0.5; 13 -7.72,0; 14 -7.72,-0.5; 15 -7.72,-1; 16 -7.72,-1.5; 17 -7.72,-2; 18 -7.72,-2.5; 19 -7.72,-3; 20 -7.72,-3.5; 21 -7.72,-4; 22 -7.72,-4.5; 23 -7.72,-5; 24 -7.72,-5.5; 25 -7.72,-6; 51 7.72,-6; 52 7.72,-5.5; 53 7.72,-5; 54 7.72,-4.5; 55 7.72,-4; 56 7.72,-3.5; 57 7.72,-3; 58 7.72,-2.5; 59 7.72,-2; 60 7.72,-1.5; 61 7.72,-1; 62 7.72,-0.5; 63 7.72,0; 64 7.72,0.5; 65 7.72,1; 66 7.72,1.5; 67 7.72,2; 68 7.72,2.5; 69 7.72,3; 70 7.72,3.5; 71 7.72,4; 72 7.72,4.5; 73 7.72,5; 74 7.72,5.5; 75 7.72,6 | smd 0.3 x 0.9: 26 -6,-7.72; 27 -5.5,-7.72; 28 -5,-7.72; 29 -4.5,-7.72; 30 -4,-7.72; 31 -3.5,-7.72; 32 -3,-7.72; 33 -2.5,-7.72; 34 -2,-7.72; 35 -1.5,-7.72; 36 -1,-7.72; 37 -0.5,-7.72; 38 0,-7.72; 39 0.5,-7.72; 40 1,-7.72; 41 1.5,-7.72; 42 2,-7.72; 43 2.5,-7.72; 44 3,-7.72; 45 3.5,-7.72; 46 4,-7.72; 47 4.5,-7.72; 48 5,-7.72; 49 5.5,-7.72; 50 6,-7.72; 76 6,7.72; 77 5.5,7.72; 78 5,7.72; 79 4.5,7.72; 80 4,7.72; 81 3.5,7.72; 82 3,7.72; 83 2.5,7.72; 84 2,7.72; 85 1.5,7.72; 86 1,7.72; 87 0.5,7.72; 88 0,7.72; 89 -0.5,7.72; 90 -1,7.72; 91 -1.5,7.72; 92 -2,7.72; 93 -2.5,7.72; 94 -3,7.72; 95 -3.5,7.72; 96 -4,7.72; 97 -4.5,7.72; 98 -5,7.72; 99 -5.5,7.72; 100 -6,7.72
SOT-223 = smd 1.219 x 2.235: 1 -2.311,-3.099; 2 0,-3.099; 3 2.311,-3.099 | smd 3.6 x 2.2: 4 0,3.099
UX60-MB-5ST = smd 2 x 0.5: 1 2.25,1.6; 2 2.25,0.8; 3 2.25,0; 4 2.25,-0.8; 5 2.25,-1.6 | smd 2.2 x 2.5: M1 -3.3,-4.2; M2 -3.3,4.2; M3 2,4.2; M4 2,-4.2 | hole 0.9: 0,-1.75; 0,1.75

### Placement (x,y rotation side)
C1  21.39,34.42 270 bottom
C2  19.59,25.41 0 bottom
C7  40.67,17.18 180 bottom
C13  5.7,12.33 90 top
C14  8.26,16.03 90 top
C15  46.03,21.04 270 bottom
C16  47.33,14.41 180 bottom
C17  46.11,38.31 90 bottom
C18  18.8,39.2 270 top
C19  19.92,1.12 0 bottom
C20  17.13,1.12 180 bottom
C21  17.33,3.51 90 bottom
C22  18.8,3.51 90 bottom
C23  17.13,5.87 0 bottom
C24  19.92,5.87 180 bottom
C25  42.53,24.8 90 bottom
C26  33.59,14.41 270 bottom
IC2  32.62,25.56 0 top
IC4  13.32,12.58 270 top
IC5  0.64,11.03 90 bottom
IC6  12.45,2.8 0 bottom
IC7  44.76,29.75 270 bottom
JP1  27.57,43.95 0 top
JP2  41.08,47.73 270 top
JP3  45.73,47.73 270 top
JP4  16.01,42.78 90 top
JP5  20.3,46.31 0 top
JTAG  6.84,8.06 0 top
LED4  12.55,29.39 90 top
LED5  12.55,24.21 90 top
LED6  49.13,6.76 180 top
LED7  49.13,9.56 0 top
MIC1  15.91,3.31 0 top
Q1  19.62,29.67 270 bottom
R7  19.11,34.04 0 bottom
R8  19.11,35.74 0 bottom
R9  8.24,12.33 90 top
R10  10.78,12.33 90 top
R11  10.78,16.03 90 top
R12  12.68,27.79 180 top
R13  12.68,22.64 180 top
R14  36.58,8.95 180 bottom
R15  43.31,9.12 180 bottom
R16  37.42,11.39 270 bottom
R17  44.23,11.39 270 bottom
R18  38.94,11.39 270 bottom
R19  45.7,11.39 270 bottom
S1  5.82,19.29 180 top
S2  5.82,29.32 0 top
S3  5.82,24.24 0 top
T1  14.89,33.03 90 bottom
T2  34.96,11.39 180 bottom
T3  41.59,11.39 180 bottom
U$1  33.53,3.89 0 bottom
U$2  31.71,26.85 0 bottom
VR1  7.25,34.93 90 top
X1  7.19,43.69 270 top

### Tracks (layer width: path | path; a pad name or v marks a point on that pad's centre or on a via)
ADC  (1 unrouted)
CTS  (1 unrouted)
DCD  (1 unrouted)
DTR  (1 unrouted)
GND
  pour Bottom: -0.4,50.4 50.4,50.4 50.4,-0.15 -0.4,-0.15
  pour Top: -0.4,50.4 50.4,50.4 50.4,-0.15 -0.4,-0.15
GPIO1  (1 unrouted)
MIC1N  (6 unrouted)
MIC1P  (6 unrouted)
N$4
  Top 0.406: IC2.P$76 27.15,41.06 JP1.1 JP1.2 28.12,43.95 IC2.P$75
N$6  (2 unrouted)
N$7  (2 unrouted)
N$8  (1 unrouted)
N$9  (1 unrouted)
N$10  (2 unrouted)
N$11  (1 unrouted)
N$12  (1 unrouted)
N$13  (2 unrouted)
N$14  (1 unrouted)
N$15  (1 unrouted)
N$16  (2 unrouted)
N$17  (1 unrouted)
N$20  (1 unrouted)
N$21  (1 unrouted)
NETLIGHT  (1 unrouted)
PWM1  (1 unrouted)
PWRKEY  (1 unrouted)
RI  (1 unrouted)
RTS  (1 unrouted)
RXD  (1 unrouted)
SIM-CLK  (2 unrouted)
SIM-DATA  (2 unrouted)
SIM-RST  (2 unrouted)
SIM-VDD  (3 unrouted)
SPK1N  (1 unrouted)
SPK1P  (1 unrouted)
STATUS  (1 unrouted)
TEMP-BATT  (1 unrouted)
TXD  (1 unrouted)
USB_5V  (1 unrouted)
USB_PWR  (1 unrouted)
VBAT  (11 unrouted)
VRTC  (2 unrouted)
XIN  (2 unrouted)
XOUT  (2 unrouted)

### Text on the board
Top: mmca
tPlace: NSL | Tracker | USB | v2.0 | EXT | CHRG | RX | BATT | BATT | EXT | TEMP | + | TX | GPS | ANT PWR | RST | NET | PWR | nullspacelabs.com
bPlace: charliex/mmca | Place either C15 or C16